# EasyEDA schematic SCH_Wifi-Marauder_2024-08-15.json
TITLE: Sheet_1; REV: 1.0; Date: 2024-08-15; Sheet: 1/1; Drawn By: mats.rohtmets; Company: Your Company
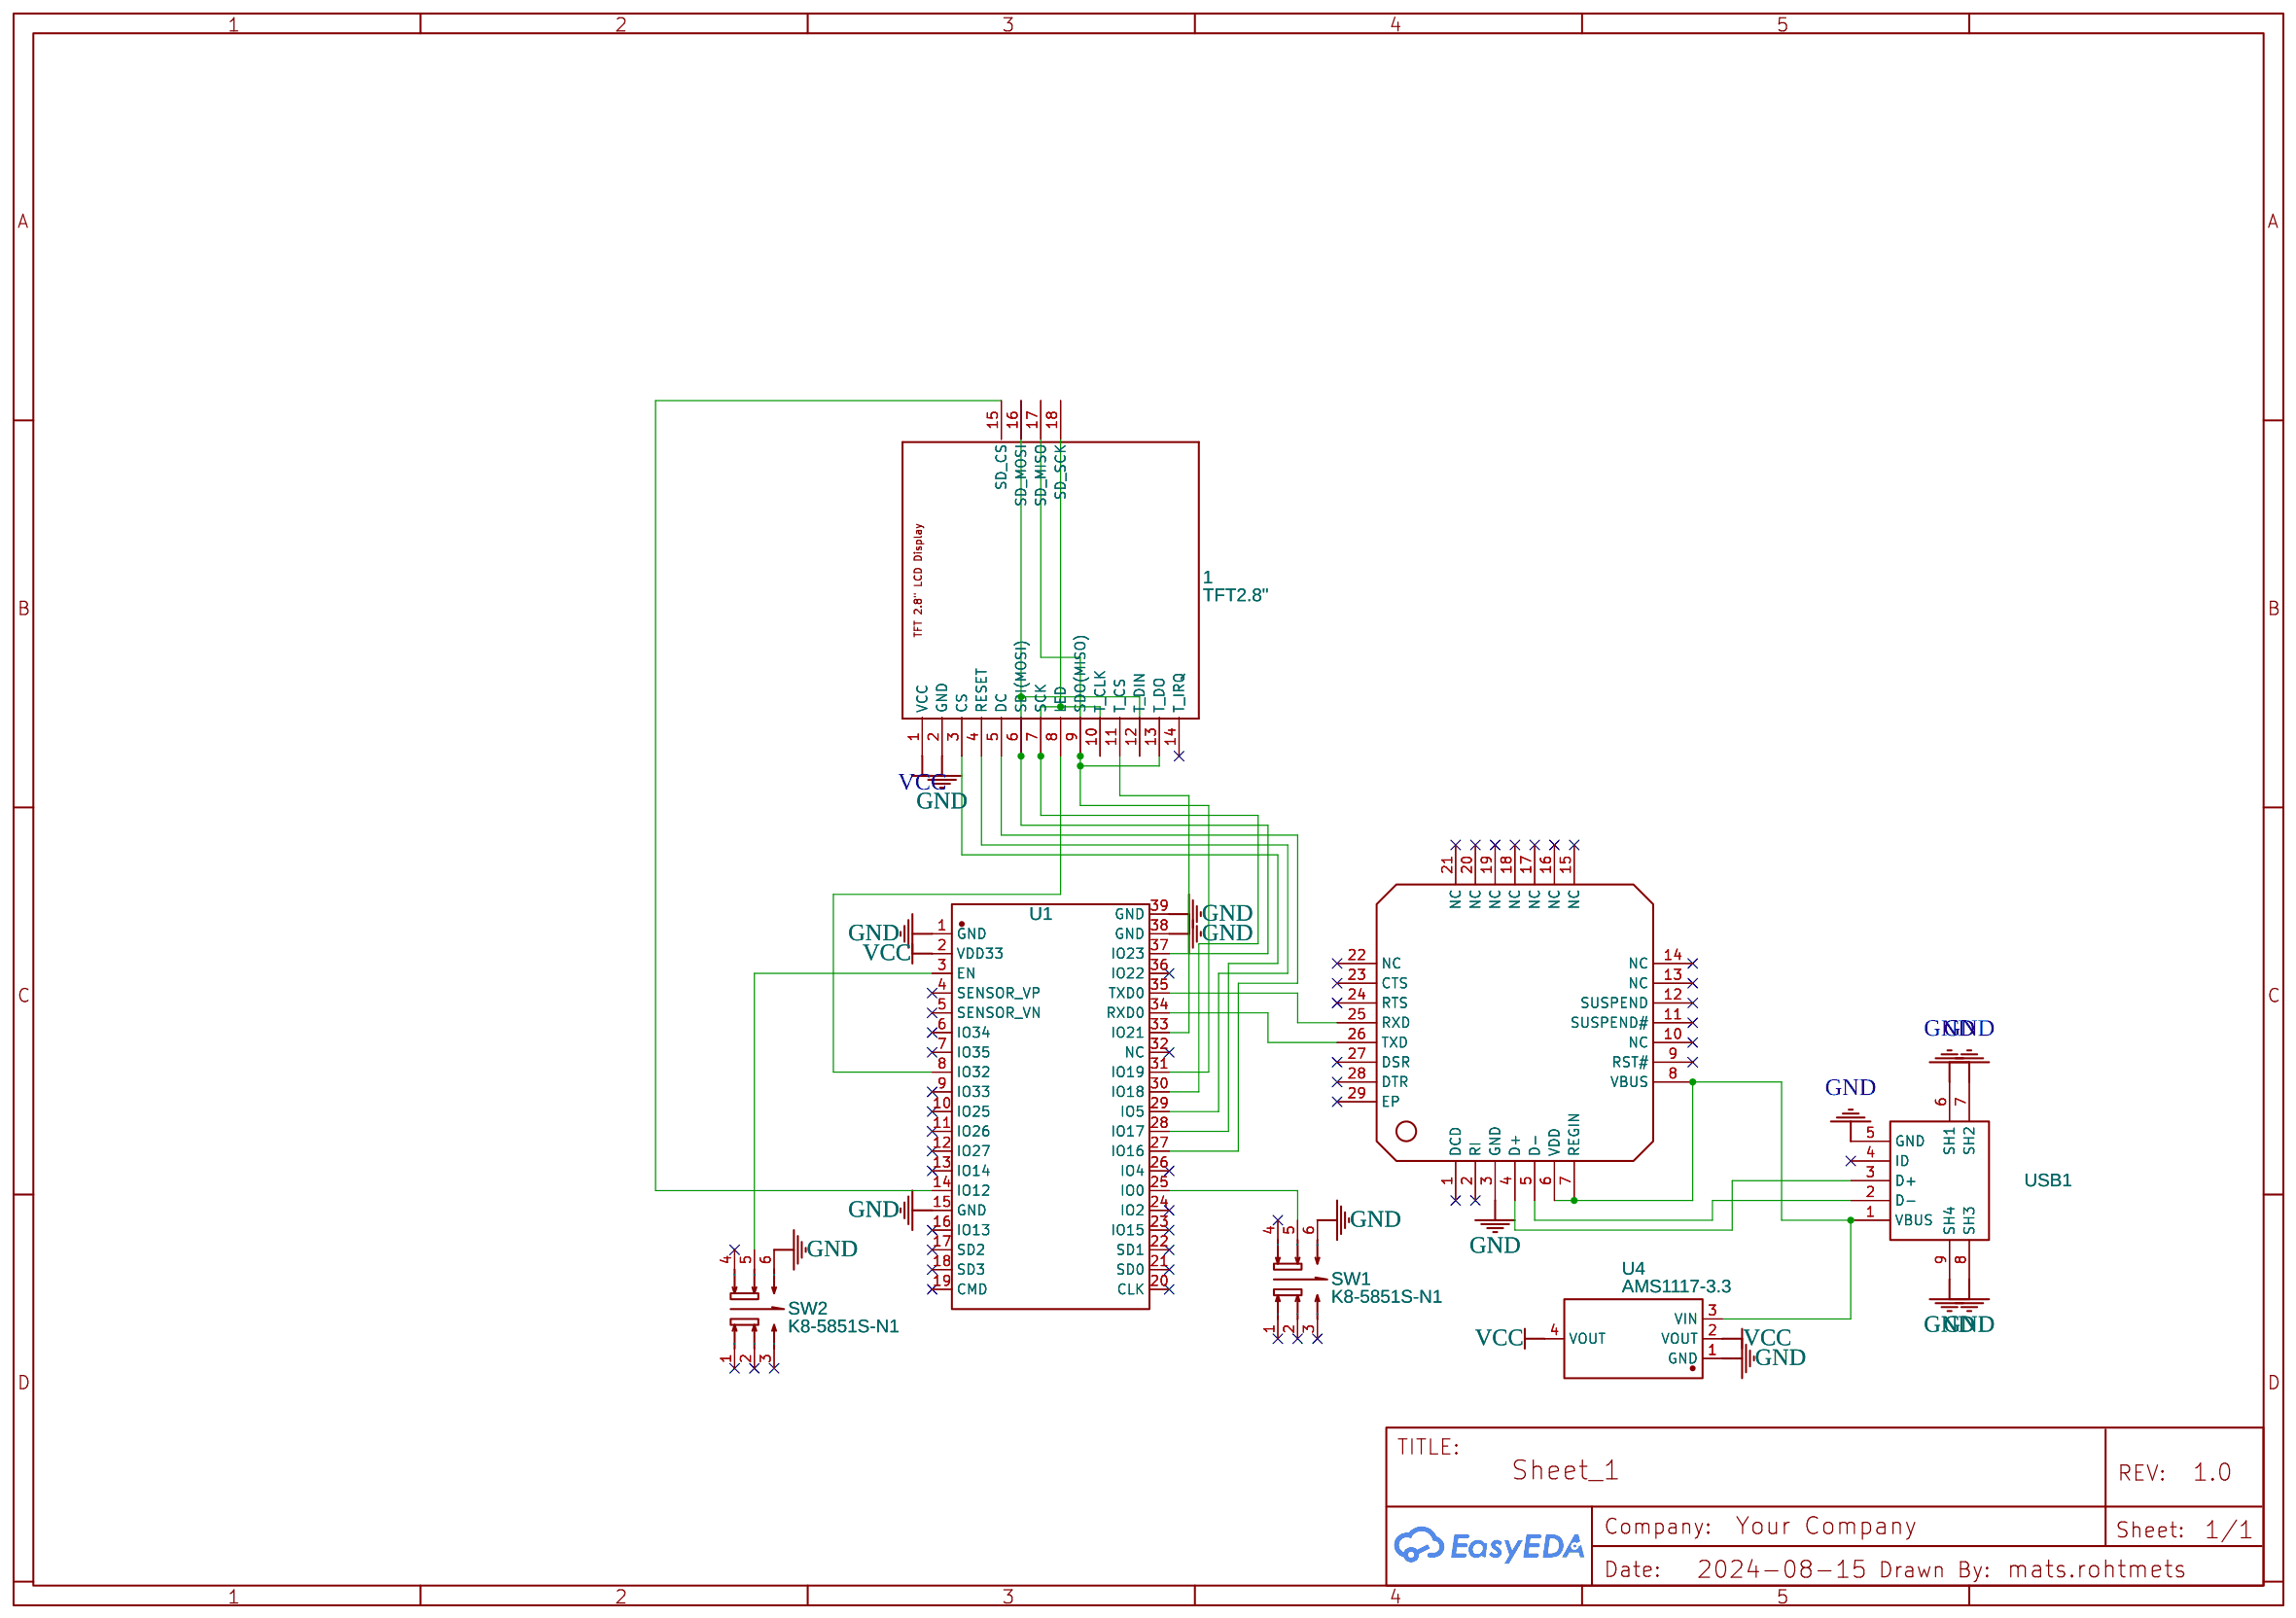
[diagram p0: schematic sheet]

## Parts
1  TFT2.8"  [TFT2.8]
SW1  K8-5851S-N1  [SW-SMD_K8-5851S-N1]
SW2  K8-5851S-N1  [SW-SMD_K8-5851S-N1]
U1  ESP32-WROOM-32U-H4  [WIFI-SMD_ESP32-WROOM-32UE-A]
U3  CP2102-GMR  [WQFN-28_L5.0-W5.0-P0.50-BL-EP3.2]
U4  AMS1117-3.3  [SOT-223-3_L6.5-W3.4-P2.30-LS7.0-BR]
USB1  MICROXNJ  [MICRO-USB-SMD_MICROXNJ]

## Library data of the parts
1 = TFT2.8": Contributor: Coop - Team
SW1 SW2 = K8-5851S-N1: Contributor: LCSC; Supplier: LCSC; Supplier Part: C509414; Manufacturer: 韩国韩荣; JLCPCB Part Class: Extended Part
U1 = ESP32-WROOM-32U-H4: Contributor: lcsc; Supplier: LCSC; Supplier Part: C3013938; Manufacturer: ESPRESSIF(乐鑫); JLCPCB Part Class: Extended Part
U3 = CP2102-GMR: Supplier: LCSC; Manufacturer: SKYWORKS/SILICON LABS(芯科); Supplier Part: C6568; JLCPCB Part Class: Extended Part
U4 = AMS1117-3.3: sourceId: dwIGgezVh; Supplier: LCSC; Manufacturer: AMS; Supplier Part: C6186; JLCPCB Part Class: Basic Part
USB1 = MICROXNJ: Contributor: LCSC; Supplier: LCSC; Supplier Part: C404969; Manufacturer: SHOU HAN(首韩); Manufacturer Part: MicroXNJ; JLCPCB Part Class: Extended Part

## Nets
GND: 1.2(GND) SW1.6 SW2.6 U1.1(GND) U1.15(GND) U1.38(GND) U1.39(GND) U3.3(GND) U4.1(GND) USB1.5(GND) USB1.6(SH1) USB1.7(SH2) USB1.8(SH3) USB1.9(SH4)
VCC: 1.1(VCC) U1.2(VDD33) U4.2(VOUT) U4.4(VOUT)
Net-(1-3): 1.3(CS) U1.28(IO17)
Net-(1-4): 1.4(RESET) U1.29(IO5)
Net-(1-5): 1.5(DC) U1.27(IO16)
Net-(1-6): 1.6(SDI(MOSI)) 1.12(T_DIN) 1.16(SD_MOSI) U1.37(IO23)
Net-(1-7): 1.7(SCK) 1.10(T_CLK) 1.18(SD_SCK) U1.30(IO18)
Net-(1-8): 1.8(LED) U1.8(IO32)
Net-(1-9): 1.9(SDO(MISO)) 1.13(T_DO) 1.17(SD_MISO) U1.31(IO19)
Net-(1-11): 1.11(T_CS) U1.33(IO21)
Net-(1-15): 1.15(SD_CS) U1.14(IO12)
Net-(SW1-5): SW1.5 U1.25(IO0)
Net-(SW2-5): SW2.5 U1.3(EN)
Net-(U1-34): U1.34(RXD0) U3.26(TXD)
Net-(U1-35): U1.35(TXD0) U3.25(RXD)
Net-(U3-4): U3.4(D+) USB1.3(D+)
Net-(U3-5): U3.5(D-) USB1.2(D-)
Net-(U3-6): U3.6(VDD) U3.7(REGIN) U3.8(VBUS) U4.3(VIN) USB1.1(VBUS)

Not connected (* = marked no-connect by the designer): 1 14(T_IRQ)*; SW1 1* 2* 3* 4*; SW2 1* 2* 3* 4*; U1 4(SENSOR_VP)* 5(SENSOR_VN)* 6(IO34)* 7(IO35)* 9(IO33)* 10(IO25)* 11(IO26)* 12(IO27)* 13(IO14)* 16(IO13)* 17(SD2)* 18(SD3)* 19(CMD)* 20(CLK)* 21(SD0)* 22(SD1)* 23(IO15)* 24(IO2)* 26(IO4)* 32(NC)* 36(IO22)*; U3 1(DCD)* 2(RI)* 9(RST#)* 10(NC)* 11(SUSPEND#)* 12(SUSPEND)* 13(NC)* 14(NC)* 15(NC)* 16(NC)* 17(NC)* 18(NC)* 19(NC)* 20(NC)* 21(NC)* 22(NC)* 23(CTS)* 24(RTS)* 27(DSR)* 28(DTR)* 29(EP)*; USB1 4(ID)*
